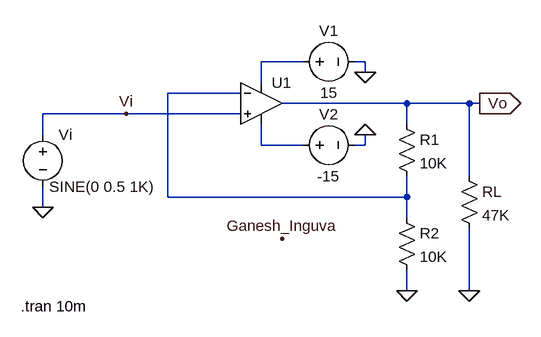
[diagram p0: schematic Run 1_C.asc]
Run 1_C.asc, the LTspice schematic file:
Version 4
SHEET 1 880 680
WIRE 224 0 160 0
WIRE 320 0 304 0
WIRE 320 16 320 0
WIRE 160 32 160 0
WIRE 128 48 16 48
WIRE 384 64 192 64
WIRE 480 64 384 64
WIRE 496 64 480 64
WIRE -48 80 -176 80
WIRE 128 80 -48 80
WIRE 384 96 384 64
WIRE -176 112 -176 80
WIRE 160 128 160 96
WIRE 224 128 160 128
WIRE 320 128 320 112
WIRE 320 128 304 128
WIRE 480 176 480 64
WIRE 16 208 16 48
WIRE 384 208 384 176
WIRE 384 208 16 208
WIRE -176 224 -176 192
WIRE 384 240 384 208
WIRE 384 352 384 320
WIRE 480 352 480 256
FLAG 320 16 0
FLAG 320 112 0
FLAG 384 352 0
FLAG 480 352 0
FLAG 496 64 Vo
IOPIN 496 64 Out
FLAG 192 272 Ganesh_Inguva
FLAG -176 224 0
FLAG -48 80 Vi
SYMBOL OpAmps\\UniversalOpamp2 160 64 R0
SYMATTR InstName U1
SYMBOL voltage 208 0 R270
WINDOW 0 32 56 VTop 2
WINDOW 3 -32 56 VBottom 2
WINDOW 123 0 0 Left 0
WINDOW 39 0 0 Left 0
SYMATTR InstName V1
SYMATTR Value 15
SYMBOL voltage 208 128 R270
WINDOW 0 32 56 VTop 2
WINDOW 3 -32 56 VBottom 2
WINDOW 123 0 0 Left 0
WINDOW 39 0 0 Left 0
SYMATTR InstName V2
SYMATTR Value -15
SYMBOL res 368 80 R0
SYMATTR InstName R1
SYMATTR Value 10K
SYMBOL res 368 224 R0
SYMATTR InstName R2
SYMATTR Value 10K
SYMBOL res 464 160 R0
SYMATTR InstName RL
SYMATTR Value 47K
SYMBOL voltage -176 96 R0
WINDOW 3 10 96 Left 2
WINDOW 123 0 0 Left 0
WINDOW 39 0 0 Left 0
SYMATTR Value SINE(0 0.5 1K)
SYMATTR InstName Vi
TEXT -210 376 Left 2 !.tran 10m

The netlist it stands for:
* Run 1_C.asc
XU1 Vi N002 N001 N003 Vo level.2 Avol=1Meg GBW=10Meg Slew=10Meg ilimit=25m rail=0 Vos=0 phimargin=45 en=0 enk=0 in=0 ink=0 Rin=500Meg  ; pins IN+ IN- V+ V- OUT
V1 N001 0 15
V2 N003 0 -15
R1 Vo N002 10K
R2 N002 0 10K
RL Vo 0 47K
Vi Vi 0 SINE(0 0.5 1K)
.tran 10m
.lib UniversalOpamps2.sub
.backanno
.end